# Altium schematic sheet PLBank12.SchDoc
size A4; SheetNumber: 8; SheetTotal: 18
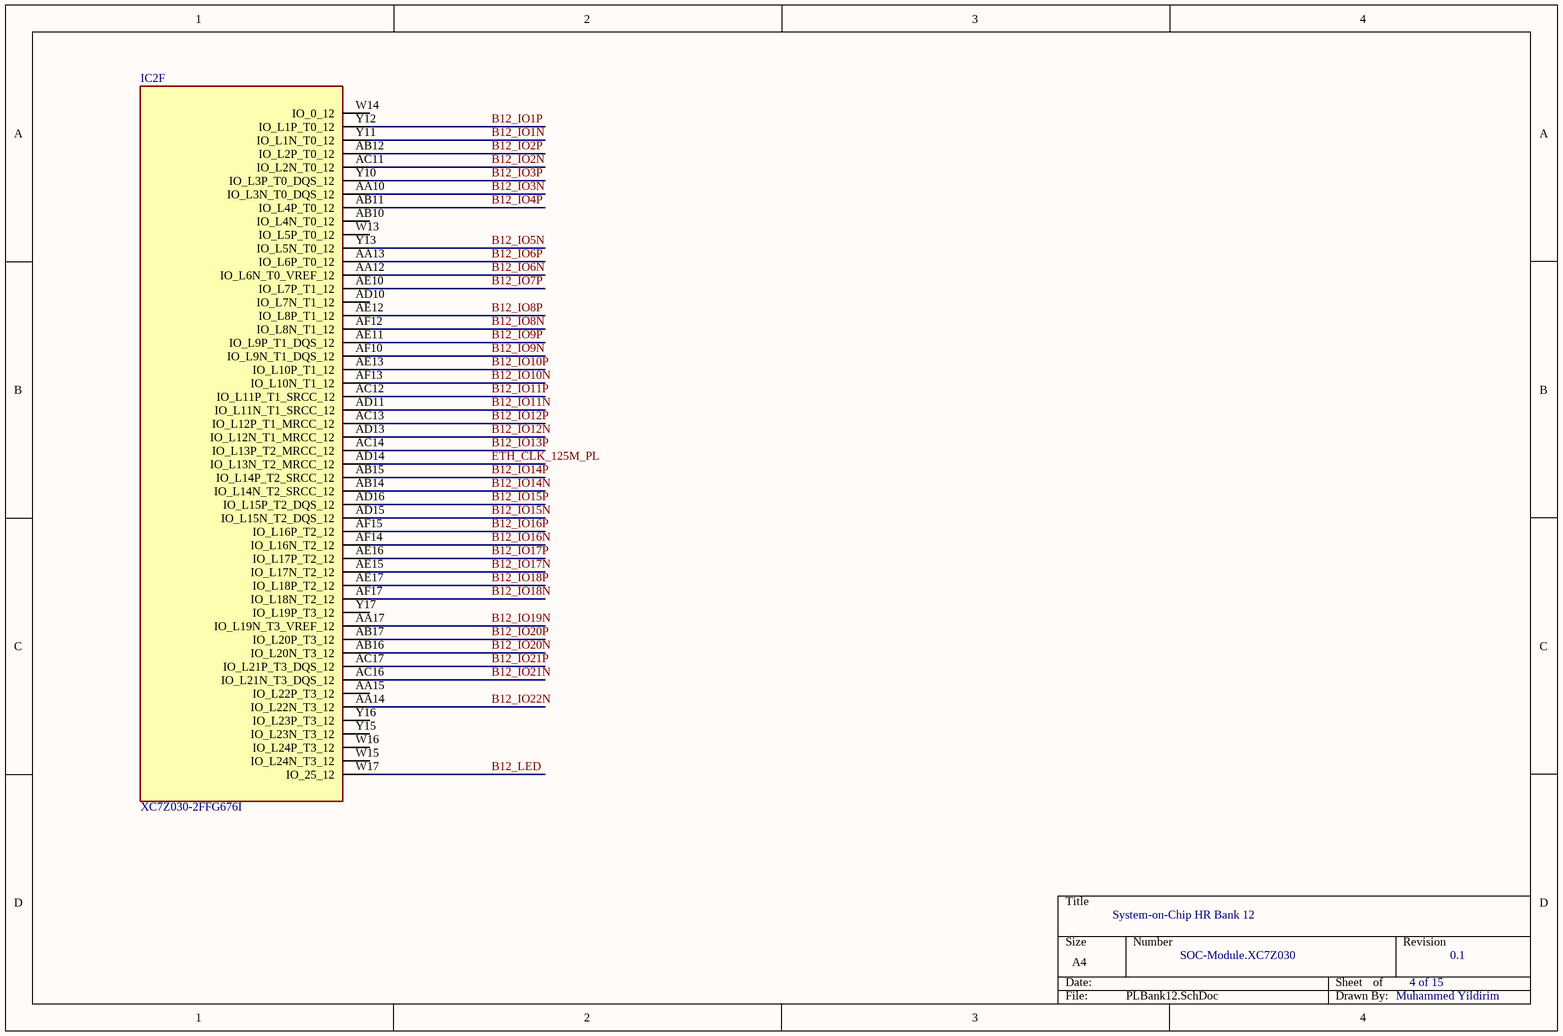
[diagram p0: PLBank12.SchDoc]

## Parts
IC2  XC7Z030-2FFG676I  [BGA676C100P26X26_2700X2700X324]  (part F of 15)

## Nets
B12_IO1N: IC2.Y11(IO_L1N_T0_12)
B12_IO1P: IC2.Y12(IO_L1P_T0_12)
B12_IO2N: IC2.AC11(IO_L2N_T0_12)
B12_IO2P: IC2.AB12(IO_L2P_T0_12)
B12_IO3N: IC2.AA10(IO_L3N_T0_DQS_12)
B12_IO3P: IC2.Y10(IO_L3P_T0_DQS_12)
B12_IO4P: IC2.AB11(IO_L4P_T0_12)
B12_IO5N: IC2.Y13(IO_L5N_T0_12)
B12_IO6N: IC2.AA12(IO_L6N_T0_VREF_12)
B12_IO6P: IC2.AA13(IO_L6P_T0_12)
B12_IO7P: IC2.AE10(IO_L7P_T1_12)
B12_IO8N: IC2.AF12(IO_L8N_T1_12)
B12_IO8P: IC2.AE12(IO_L8P_T1_12)
B12_IO9N: IC2.AF10(IO_L9N_T1_DQS_12)
B12_IO9P: IC2.AE11(IO_L9P_T1_DQS_12)
B12_IO10N: IC2.AF13(IO_L10N_T1_12)
B12_IO10P: IC2.AE13(IO_L10P_T1_12)
B12_IO11N: IC2.AD11(IO_L11N_T1_SRCC_12)
B12_IO11P: IC2.AC12(IO_L11P_T1_SRCC_12)
B12_IO12N: IC2.AD13(IO_L12N_T1_MRCC_12)
B12_IO12P: IC2.AC13(IO_L12P_T1_MRCC_12)
B12_IO13P: IC2.AC14(IO_L13P_T2_MRCC_12)
B12_IO14N: IC2.AB14(IO_L14N_T2_SRCC_12)
B12_IO14P: IC2.AB15(IO_L14P_T2_SRCC_12)
B12_IO15N: IC2.AD15(IO_L15N_T2_DQS_12)
B12_IO15P: IC2.AD16(IO_L15P_T2_DQS_12)
B12_IO16N: IC2.AF14(IO_L16N_T2_12)
B12_IO16P: IC2.AF15(IO_L16P_T2_12)
B12_IO17N: IC2.AE15(IO_L17N_T2_12)
B12_IO17P: IC2.AE16(IO_L17P_T2_12)
B12_IO18N: IC2.AF17(IO_L18N_T2_12)
B12_IO18P: IC2.AE17(IO_L18P_T2_12)
B12_IO19N: IC2.AA17(IO_L19N_T3_VREF_12)
B12_IO20N: IC2.AB16(IO_L20N_T3_12)
B12_IO20P: IC2.AB17(IO_L20P_T3_12)
B12_IO21N: IC2.AC16(IO_L21N_T3_DQS_12)
B12_IO21P: IC2.AC17(IO_L21P_T3_DQS_12)
B12_IO22N: IC2.AA14(IO_L22N_T3_12)
B12_LED: IC2.W17(IO_25_12)
ETH_CLK_125M_PL: IC2.AD14(IO_L13N_T2_MRCC_12)

Not connected (* = marked no-connect by the designer): IC2 AA15(IO_L22P_T3_12) AB10(IO_L4N_T0_12) AD10(IO_L7N_T1_12) W13(IO_L5P_T0_12) W14(IO_0_12) W15(IO_L24N_T3_12) W16(IO_L24P_T3_12) Y15(IO_L23N_T3_12) Y16(IO_L23P_T3_12) Y17(IO_L19P_T3_12)

## Notes on the sheet
- System-on-Chip HR Bank 12
- SOC-Module.XC7Z030
- 4 of 15
- 0.1
- Muhammed Yildirim

## Library data of the parts
IC2 = XC7Z030-2FFG676I: Integrated Circuit; Manufacturer_Name: AMD; Datasheet Link: http://www.xilinx.com/support/documentation/data_sheets/ds190-Zynq-7000-Overview.pdf; Height: 3.24mm; Manufacturer_Part_Number: XC7Z030-2FFG676I; Mouser Part Number: 217-XC7Z030-2FFG676I; Mouser Price/Stock: https://www.mouser.co.uk/ProductDetail/Xilinx/XC7Z030-2FFG676I?qs=rrS6PyfT74cuZK5O3CSpmw%3D%3D